# Altium schematic sheet DC-DCConverter.SchDoc
size A
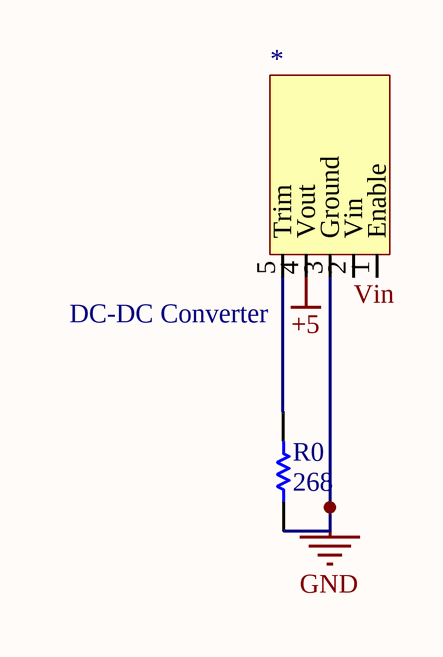
[diagram p0: DC-DCConverter.SchDoc]

## Parts
*  DC-DC Converter  [NE12S0A0V10PNFA]
R0  value 268  [AXIAL-0.3]

## Nets
+5: *.4(Vout)
GND: *.3(Ground) R0.1
Vin: *.2(Vin)
Net*_5: *.5(Trim) R0.2

Not connected (* = marked no-connect by the designer): * 1(Enable)

## Library data of the parts
* = Component_1
R0 = Res1: Resistor; Published: 8-Jun-2000; LatestRevisionDate: 17-Jul-2002; LatestRevisionNote: Re-released for DXP Platform.; PackageReference: AXIAL-0.3; Publisher: Altium Limited; PackageDescription: Axial Device, Thru-Hole; 2 Leads; 0.3 in Pin Spacing